# Altium schematic sheet PJ-3210-4A1_PJ-3210-4A.schdoc
size 124 x 101 mm
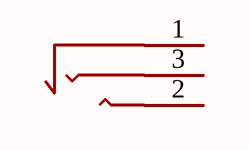
[diagram p0: PJ-3210-4A1_PJ-3210-4A.schdoc]

## Parts
AUDIO?  PJ-3210-4A  [AUDIO_TH_PJ-3210-4A]  (value not drawn)

## Nets

Not connected (* = marked no-connect by the designer): AUDIO? 1 2 3

## Library data of the parts
AUDIO? = PJ-3210-4A: Manufacturer: 韩国韩荣; Add into BOM: yes; Connector Type: 3.5mm耳机座; Current Rating (Max): 500mA; Voltage Rating (Max): 30V; Symbol: PJ-3210-4A; Device: PJ-3210-4A; LCSC Part Name: 3.5mm耳机座; Supplier Part: C136686; Manufacturer Part: PJ-3210-4A; Supplier Footprint: 插件; JLCPCB Part Class: Extended Part; Datasheet: https://atta.szlcsc.com/upload/public/pdf/source/20191118/C136686_396549F4507BFC9F529DC3FBCB3E7959.pdf; Supplier: LCSC; Convert to PCB: yes